# Altium schematic sheet Dentist_camera_extender_schematic_sch_3.SchDoc
size A3; SheetNumber: 3; SheetTotal: 3
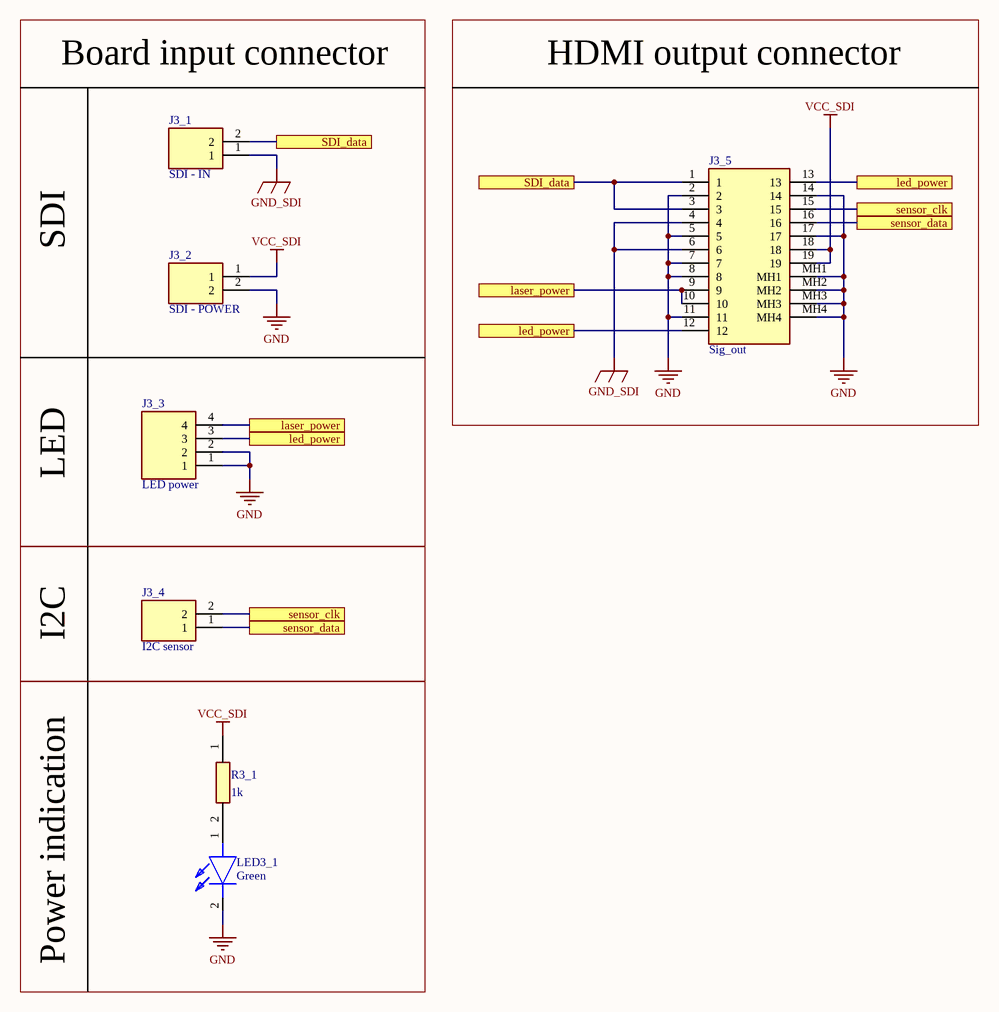
[diagram p0: Dentist_camera_extender_schematic_sch_3.SchDoc]

## Parts
J3_1  SDI - IN  [B02BJWPFSKRLFSN]
J3_2  SDI - POWER  [B02BJWPFSKRLFSN]
J3_3  LED power  [B04BJWPFSKRLFSN]
J3_4  I2C sensor  [B02BJWPFSKRLFSN]
J3_5  Sig_out  [10029449001RLF]
LED3_1  Green  [1721SYGCS530E2TR8]
R3_1  1k  [ERA6AEB1020V]

## Blocks framed on the sheet
HDMI output connector: J3_5
I2C: J3_4
Power indication: LED3_1 R3_1

## Ports
laser_power, led_power, SDI_data, sensor_clk, sensor_data

## Nets
GND: J3_2.2 J3_3.1 J3_3.2 J3_5.2 J3_5.5 J3_5.7 J3_5.8 J3_5.11 J3_5.14 J3_5.17 J3_5.MH1 J3_5.MH2 J3_5.MH3 J3_5.MH4 LED3_1.2(K)
GND_SDI: J3_1.1 J3_5.4 J3_5.6
VCC_SDI: J3_2.1 J3_5.18 J3_5.19 R3_1.1
laser_power: J3_3.4 J3_5.9 J3_5.10 ; port laser_power
led_power: J3_3.3 J3_5.12 J3_5.13 ; port led_power
SDI_data: J3_1.2 J3_5.1 J3_5.3 ; port SDI_data
sensor_clk: J3_4.2 J3_5.15 ; port sensor_clk
sensor_data: J3_4.1 J3_5.16 ; port sensor_data
NetLED3_1_1: LED3_1.1(A) R3_1.2

## Notes on the sheet
- Board input connector
- SDI
- LED

## Library data of the parts
J3_1 J3_2 J3_4 = B02B-JWPF-SK-R_LF__SN_: Connector; Manufacturer_Name: JST (JAPAN SOLDERLESS TERMINALS); Manufacturer_Part_Number: B02B-JWPF-SK-R(LF)(SN); Datasheet Link: https://datasheet.datasheetarchive.com/originals/dk/DKDS-13/257039.pdf; Height: 16.6mm; Arrow Part Number: B02B-JWPF-SK-R(LF)(SN); Arrow Price/Stock: https://www.arrow.com/en/products/b02b-jwpf-sk-r-lf-sn/jst-manufacturing
J3_3 = B04B-JWPF-SK-R_LF__SN_: Connector; Manufacturer_Name: JST (JAPAN SOLDERLESS TERMINALS); Manufacturer_Part_Number: B04B-JWPF-SK-R(LF)(SN); Datasheet Link: https://componentsearchengine.com/Datasheets/2/B04B-JWPF-SK-R(LF)(SN).pdf; Height: 16.6mm
J3_5 = 10029449-001RLF: Manufacturer_Name: Amphenol; Datasheet Link: https://cdn.amphenol-icc.com/media/wysiwyg/files/drawing/10029449.pdf; Height: 6.3mm; Manufacturer_Part_Number: 10029449-001RLF; Mouser Part Number: 649-10029449-001RLF; Mouser Price/Stock: https://www.mouser.co.uk/ProductDetail/Amphenol-FCI/10029449-001RLF?qs=D%252By4jQJzx8L60NhBOOKSqQ%3D%3D; Arrow Part Number: 10029449-001RLF; Arrow Price/Stock: https://www.arrow.com/en/products/10029449-001rlf/amphenol-fci?region=nac
LED3_1 = 17-21SYGC_S530-E2_TR8: LED; Manufacturer_Name: Everlight; Manufacturer_Part_Number: 17-21SYGC/S530-E2/TR8; Datasheet Link: https://media.digikey.com/pdf/Data%20Sheets/Everlight%20PDFs/17-21SYGC,S530-E2,TR8.pdf; Height: 1.1mm; Mouser Part Number: 638-1721SYGCS530E2; Mouser Price/Stock: https://www.mouser.co.uk/ProductDetail/Everlight/17-21SYGC-S530-E2-TR8?qs=8PzhAHr7IdMM%252BF4DSbsAKQ%3D%3D; Arrow Part Number: 17-21SYGC/S530-E2/TR8; Arrow Price/Stock: https://www.arrow.com/en/products/17-21sygcs530-e2tr8/everlight-electronics?region=nac
R3_1 = ERA6ARB103V: Manufacturer_Name: Panasonic; Datasheet Link: https://industrial.panasonic.com/cdbs/www-data/pdf/RDM0000/AOA0000C307.pdf; Height: 0.6mm; Manufacturer_Part_Number: ERA6ARB103V; Arrow Part Number: ERA6ARB103V; Arrow Price/Stock: https://www.arrow.com/en/products/era-6arb103v/panasonic